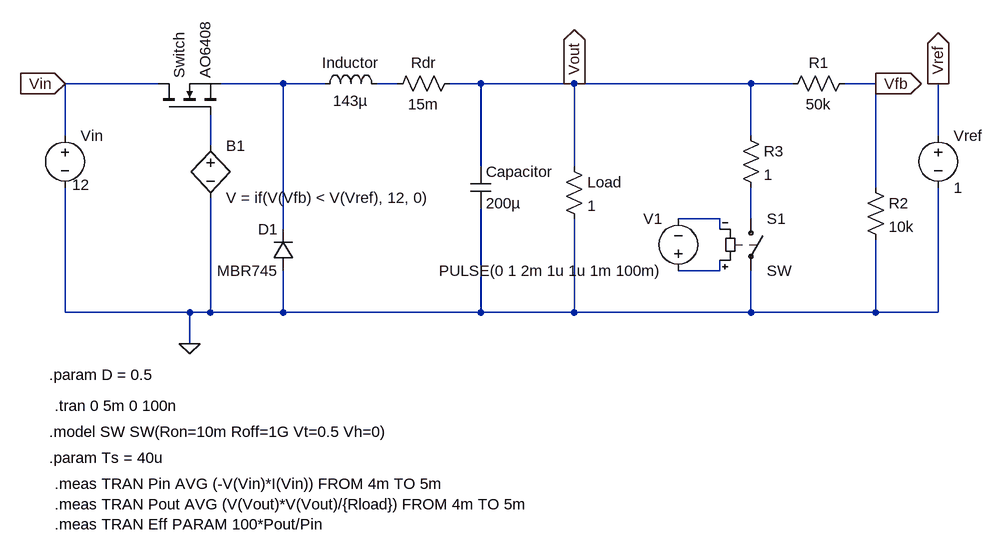
[diagram p0: schematic Simulation file.asc]
Simulation file.asc, the LTspice schematic file:
Version 4.1
SHEET 1 1744 768
WIRE 160 80 16 80
WIRE 352 80 256 80
WIRE 416 80 352 80
WIRE 528 80 496 80
WIRE 656 80 608 80
WIRE 800 80 656 80
WIRE 1072 80 800 80
WIRE 1136 80 1072 80
WIRE 1264 80 1216 80
WIRE 16 160 16 80
WIRE 1072 160 1072 80
WIRE 1360 160 1360 80
WIRE 240 176 240 128
WIRE 656 208 656 80
WIRE 800 208 800 80
WIRE 1264 240 1264 80
WIRE 1024 288 960 288
WIRE 1072 288 1072 240
WIRE 352 304 352 80
WIRE 1024 304 1024 288
WIRE 1024 368 1024 352
WIRE 1024 368 960 368
WIRE 16 432 16 240
WIRE 208 432 16 432
WIRE 240 432 240 256
WIRE 240 432 208 432
WIRE 352 432 352 368
WIRE 352 432 240 432
WIRE 656 432 656 272
WIRE 656 432 352 432
WIRE 800 432 800 288
WIRE 800 432 656 432
WIRE 1072 432 1072 368
WIRE 1072 432 800 432
WIRE 1264 432 1264 320
WIRE 1264 432 1072 432
WIRE 1360 432 1360 240
WIRE 1360 432 1264 432
WIRE 208 480 208 432
FLAG 208 480 0
FLAG 16 80 Vin
IOPIN 16 80 In
FLAG 800 80 Vout
IOPIN 800 80 Out
FLAG 1264 80 Vfb
IOPIN 1264 80 Out
FLAG 1360 80 Vref
IOPIN 1360 80 Out
SYMBOL voltage 16 144 R0
WINDOW 123 0 0 Left 0
WINDOW 39 0 0 Left 0
WINDOW 3 11 92 Left 2
SYMATTR Value 12
SYMATTR InstName Vin
SYMBOL nmos 160 128 R270
SYMATTR InstName Switch
SYMATTR Value AO6408
SYMBOL ind 400 96 R270
WINDOW 0 32 56 VTop 2
WINDOW 3 5 56 VBottom 2
SYMATTR InstName Inductor
SYMATTR Value 143µ
SYMATTR SpiceLine Rser=20m
SYMBOL cap 640 208 R0
SYMATTR InstName Capacitor
SYMATTR Value 200µ
SYMATTR SpiceLine Rser=1m
SYMBOL res 784 192 R0
SYMATTR InstName Load
SYMATTR Value 1
SYMBOL res 624 64 R90
WINDOW 0 0 56 VBottom 2
WINDOW 3 32 56 VTop 2
SYMATTR InstName Rdr
SYMATTR Value 15m
SYMBOL diode 368 368 R180
WINDOW 0 24 64 Left 2
WINDOW 3 24 0 Left 2
SYMATTR InstName D1
SYMATTR Value MBR745
SYMBOL res 1232 64 R90
WINDOW 0 0 56 VBottom 2
WINDOW 3 32 56 VTop 2
SYMATTR InstName R1
SYMATTR Value 50k
SYMBOL res 1248 224 R0
SYMATTR InstName R2
SYMATTR Value 10k
SYMBOL voltage 1360 144 R0
WINDOW 123 0 0 Left 0
WINDOW 39 0 0 Left 0
SYMATTR InstName Vref
SYMATTR Value 1
SYMBOL bv 240 160 R0
SYMATTR InstName B1
SYMATTR Value V = if(V(Vfb) < V(Vref), 12, 0)
SYMBOL res 1056 144 R0
SYMATTR InstName R3
SYMATTR Value 1
SYMBOL sw 1072 272 R0
SYMATTR InstName S1
SYMBOL voltage 960 384 R180
WINDOW 0 24 96 Left 2
WINDOW 3 24 16 Left 2
WINDOW 123 0 0 Left 0
WINDOW 39 0 0 Left 0
SYMATTR InstName V1
SYMATTR Value PULSE(0 1 2m 1u 1u 1m 100m)
TEXT -8 528 Left 2 !.param D = 0.5
TEXT -8 656 Left 2 !.param Ts = 40u
TEXT 0 696 Left 2 !.meas TRAN Pin AVG (-V(Vin)*I(Vin)) FROM 4m TO 5m\n.meas TRAN Pout AVG (V(Vout)*V(Vout)/{Rload}) FROM 4m TO 5m\n.meas TRAN Eff PARAM 100*Pout/Pin
TEXT 0 576 Left 2 !.tran 0 5m 0 100n
TEXT -8 616 Left 2 !.model SW SW(Ron=10m Roff=1G Vt=0.5 Vh=0)

The netlist it stands for:
* Simulation file.asc
Vin Vin 0 12
M§Switch Vin N003 N001 N001 AO6408
L§Inductor N001 N002 143µ Rser=20m
Capacitor Vout 0 200µ Rser=1m
R§Load Vout 0 1
Rdr Vout N002 15m
D1 0 N001 MBR745
R1 Vfb Vout 50k
R2 Vfb 0 10k
Vref Vref 0 1
B1 N003 0 V = if(V(Vfb) < V(Vref), 12, 0)
R3 Vout N005 1
S1 N005 0 N006 N004 SW
V1 N006 N004 PULSE(0 1 2m 1u 1u 1m 100m)
.model D D
.lib standard.dio
.model NMOS NMOS
.model PMOS PMOS
.lib standard.mos
.param D = 0.5
.param Ts = 40u
.meas TRAN Pin AVG (-V(Vin)*I(Vin)) FROM 4m TO 5m
.meas TRAN Pout AVG (V(Vout)*V(Vout)/{Rload}) FROM 4m TO 5m
.meas TRAN Eff PARAM 100*Pout/Pin
.tran 0 5m 0 100n
.model SW SW(Ron=10m Roff=1G Vt=0.5 Vh=0)
.backanno
.end